# EAGLE design backplane (EAGLE 7.7.0)
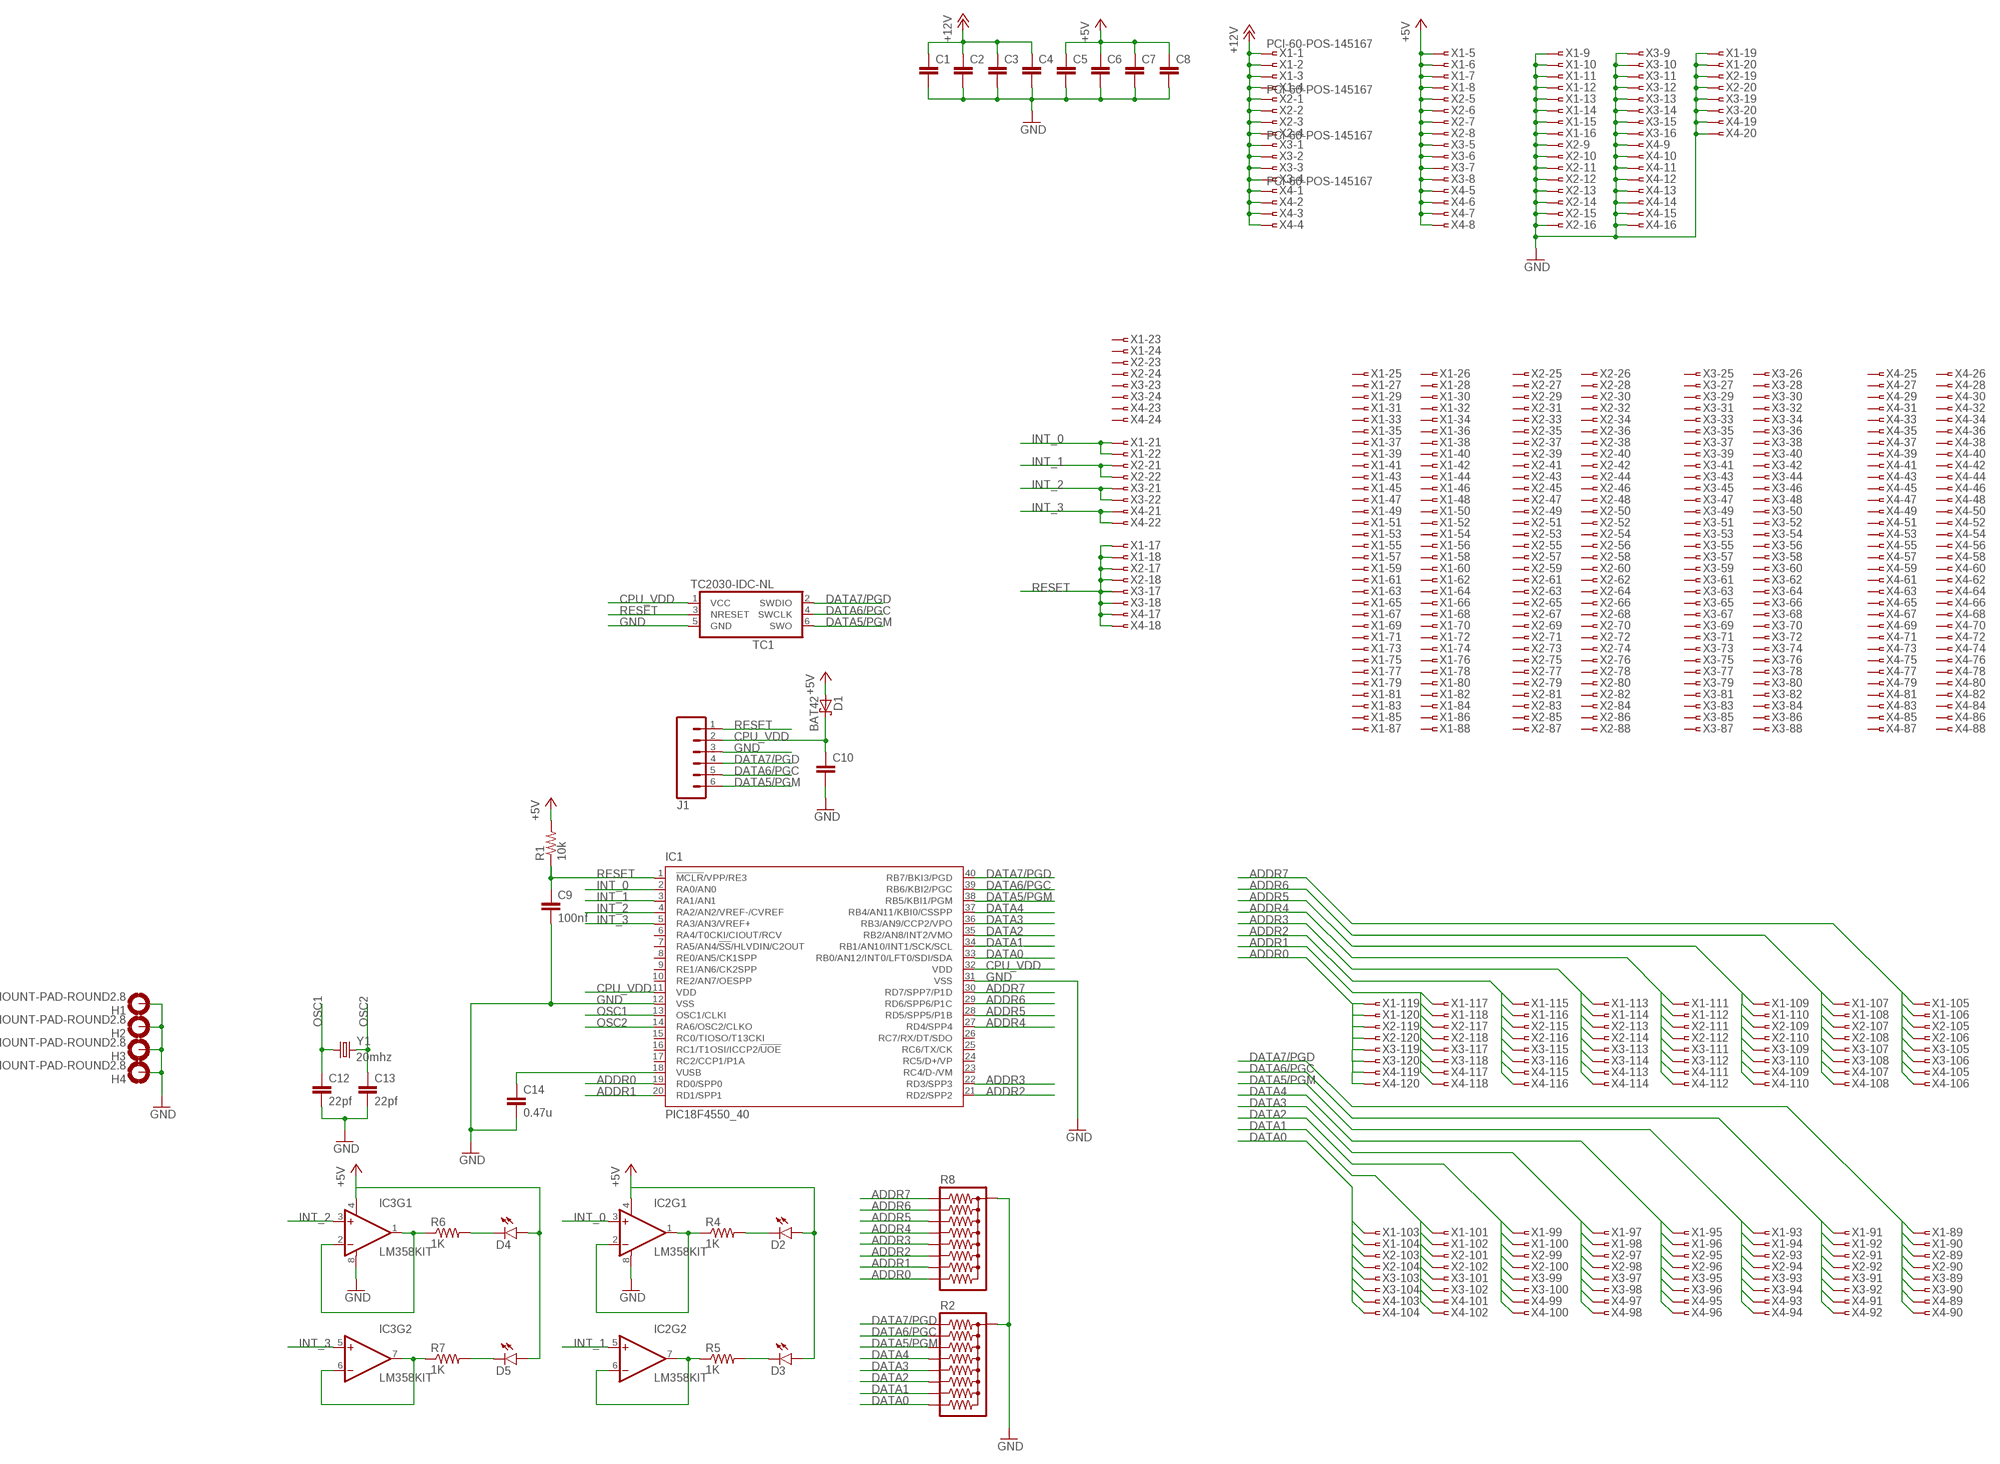
[diagram p0: schematic, sheet 1]

## Parts
C1  0.1UF-50V-20%(PTH)KIT-EZ  [CAP-PTH-SMALL-KIT]
C2  0.1UF-50V-20%(PTH)KIT-EZ  [CAP-PTH-SMALL-KIT]
C3  0.1UF-50V-20%(PTH)KIT-EZ  [CAP-PTH-SMALL-KIT]
C4  0.1UF-50V-20%(PTH)KIT-EZ  [CAP-PTH-SMALL-KIT]
C5  0.1UF-50V-20%(PTH)KIT-EZ  [CAP-PTH-SMALL-KIT]
C6  0.1UF-50V-20%(PTH)KIT-EZ  [CAP-PTH-SMALL-KIT]
C7  0.1UF-50V-20%(PTH)KIT-EZ  [CAP-PTH-SMALL-KIT]
C8  0.1UF-50V-20%(PTH)KIT-EZ  [CAP-PTH-SMALL-KIT]
C9  100nf  0.1UF-50V-20%(PTH)KIT-EZ  [CAP-PTH-SMALL-KIT]
C10  0.1UF-50V-20%(PTH)KIT-EZ  [CAP-PTH-SMALL-KIT]
C12  22pf  CAPKIT  [CAP-PTH-SMALL-KIT]
C13  22pf  CAPKIT  [CAP-PTH-SMALL-KIT]
C14  0.47u  CAPKIT  [CAP-PTH-SMALL-KIT]
D1  BAT42  [DO35-10]
D2  LED3MM  [LED3MM]
D3  LED3MM  [LED3MM]
D4  LED3MM  [LED3MM]
D5  LED3MM  [LED3MM]
H1  MOUNT-PAD-ROUND2.8  [2,8-PAD]
H2  MOUNT-PAD-ROUND2.8  [2,8-PAD]
H3  MOUNT-PAD-ROUND2.8  [2,8-PAD]
H4  MOUNT-PAD-ROUND2.8  [2,8-PAD]
IC1  PIC18F4550_40  [DIL40]
IC2  LM358KIT  [DIP08-KIT]
IC3  LM358KIT  [DIP08-KIT]
J1  M06POLAR_LOCK  [MOLEX-1X6_LOCK]
R1  10k  10KOHM-1/4W-1%(PTH)HORIZ-KIT  [AXIAL-0.3EZ]
R2  RPACK-BUSSED-8-SIP-PTH-8  [RPACK-SIP-PTH-8]
R4  1K  1KOHM-1/4W-1%(PTH)VERT-KIT  [AXIAL-0.1EZ]
R5  1K  1KOHM-1/4W-1%(PTH)VERT-KIT  [AXIAL-0.1EZ]
R6  1K  1KOHM-1/4W-1%(PTH)VERT-KIT  [AXIAL-0.1EZ]
R7  1K  1KOHM-1/4W-1%(PTH)VERT-KIT  [AXIAL-0.1EZ]
R8  RPACK-BUSSED-8-SIP-PTH-8  [RPACK-SIP-PTH-8]
TC1  TC2030-IDC-NL  [TC2030-IDC-NL]
X1  PCI-60-POS-145167  [145167-2]
X2  PCI-60-POS-145167  [145167-2]
X3  PCI-60-POS-145167  [145167-2]
X4  PCI-60-POS-145167  [145167-2]
Y1  20mhz  CRYSTALHC49UV  [HC49U-V]

## Nets
+5V: C5.1 C6.1 C7.1 C8.1 D1.A D2.A D3.A D4.A D5.A IC2.4(V-) IC3.4(V-) R1.P$2 X1.5 X1.6 X1.7 X1.8 X2.5 X2.6 X2.7 X2.8 X3.5 X3.6 X3.7 X3.8 X4.5 X4.6 X4.7 X4.8
+12V: C1.1 C2.1 C3.1 C4.1 X1.1 X1.2 X1.3 X1.4 X2.1 X2.2 X2.3 X2.4 X3.1 X3.2 X3.3 X3.4 X4.1 X4.2 X4.3 X4.4
ADDR0: IC1.19(RD0/SPP0) R8.P$9 X1.119 X1.120 X2.119 X2.120 X3.119 X3.120 X4.119 X4.120
ADDR1: IC1.20(RD1/SPP1) R8.P$8 X1.117 X1.118 X2.117 X2.118 X3.117 X3.118 X4.117 X4.118
ADDR2: IC1.21(RD2/SPP2) R8.P$7 X1.115 X1.116 X2.115 X2.116 X3.115 X3.116 X4.115 X4.116
ADDR3: IC1.22(RD3/SPP3) R8.P$6 X1.113 X1.114 X2.113 X2.114 X3.113 X3.114 X4.113 X4.114
ADDR4: IC1.27(RD4/SPP4) R8.P$5 X1.111 X1.112 X2.111 X2.112 X3.111 X3.112 X4.111 X4.112
ADDR5: IC1.28(RD5/SPP5/P1B) R8.P$4 X1.109 X1.110 X2.109 X2.110 X3.109 X3.110 X4.109 X4.110
ADDR6: IC1.29(RD6/SPP6/P1C) R8.P$3 X1.107 X1.108 X2.107 X2.108 X3.107 X3.108 X4.107 X4.108
ADDR7: IC1.30(RD7/SPP7/P1D) R8.P$2 X1.105 X1.106 X2.105 X2.106 X3.105 X3.106 X4.105 X4.106
CPU_VDD: C10.1 D1.C IC1.11(VDD) IC1.32(VDD) J1.2 TC1.1(VCC)
DATA0: IC1.33(RB0/AN12/INT0/LFT0/SDI/SDA) R2.P$9 X1.103 X1.104 X2.103 X2.104 X3.103 X3.104 X4.103 X4.104
DATA1: IC1.34(RB1/AN10/INT1/SCK/SCL) R2.P$8 X1.101 X1.102 X2.101 X2.102 X3.101 X3.102 X4.101 X4.102
DATA2: IC1.35(RB2/AN8/INT2/VMO) R2.P$7 X1.99 X1.100 X2.99 X2.100 X3.99 X3.100 X4.99 X4.100
DATA3: IC1.36(RB3/AN9/CCP2/VPO) R2.P$6 X1.97 X1.98 X2.97 X2.98 X3.97 X3.98 X4.97 X4.98
DATA4: IC1.37(RB4/AN11/KBI0/CSSPP) R2.P$5 X1.95 X1.96 X2.95 X2.96 X3.95 X3.96 X4.95 X4.96
DATA5/PGM: IC1.38(RB5/KBI1/PGM) J1.6 R2.P$4 TC1.6(SWO) X1.93 X1.94 X2.93 X2.94 X3.93 X3.94 X4.93 X4.94
DATA6/PGC: IC1.39(RB6/KBI2/PGC) J1.5 R2.P$3 TC1.4(SWCLK) X1.91 X1.92 X2.91 X2.92 X3.91 X3.92 X4.91 X4.92
DATA7/PGD: IC1.40(RB7/BKI3/PGD) J1.4 R2.P$2 TC1.2(SWDIO) X1.89 X1.90 X2.89 X2.90 X3.89 X3.90 X4.89 X4.90
GND: C1.2 C2.2 C3.2 C4.2 C5.2 C6.2 C7.2 C8.2 C9.2 C10.2 C12.2 C13.2 C14.2 H1.B2,8(MOUNT) H2.B2,8(MOUNT) H3.B2,8(MOUNT) H4.B2,8(MOUNT) IC1.12(VSS) IC1.31(VSS) IC2.8(V+) IC3.8(V+) J1.3 R2.P$1 R8.P$1 TC1.5(GND) X1.9 X1.10 X1.11 X1.12 X1.13 X1.14 X1.15 X1.16 X1.19 X1.20 X2.9 X2.10 X2.11 X2.12 X2.13 X2.14 X2.15 X2.16 X2.19 X2.20 X3.9 X3.10 X3.11 X3.12 X3.13 X3.14 X3.15 X3.16 X3.19 X3.20 X4.9 X4.10 X4.11 X4.12 X4.13 X4.14 X4.15 X4.16 X4.19 X4.20
INT_0: IC1.2(RA0/AN0) IC2.3(+IN) X1.21 X1.22
INT_1: IC1.3(RA1/AN1) IC2.5(+IN) X2.21 X2.22
INT_2: IC1.4(RA2/AN2/VREF-/CVREF) IC3.3(+IN) X3.21 X3.22
INT_3: IC1.5(RA3/AN3/VREF+) IC3.5(+IN) X4.21 X4.22
N$1: D2.K(C) R4.P$2
N$2: D3.K(C) R5.P$2
N$3: IC2.6(-IN) IC2.7(OUT) R5.P$1
N$4: IC2.1(OUT) IC2.2(-IN) R4.P$1
N$5: D4.K(C) R6.P$2
N$6: D5.K(C) R7.P$2
N$7: IC3.6(-IN) IC3.7(OUT) R7.P$1
N$8: IC3.1(OUT) IC3.2(-IN) R6.P$1
N$9: C14.1 IC1.18(VUSB)
OSC1: C12.1 IC1.13(OSC1/CLKI) Y1.1
OSC2: C13.1 IC1.14(RA6/OSC2/CLKO) Y1.2
RESET: C9.1 IC1.1(!MCLR!/VPP/RE3) J1.1 R1.P$1 TC1.3(NRESET) X1.17 X1.18 X2.17 X2.18 X3.17 X3.18 X4.17 X4.18
Unconnected: IC1.6(RA4/T0CKI/CIOUT/RCV) IC1.7(RA5/AN4/!SS!/HLVDIN/C2OUT) IC1.8(RE0/AN5/CK1SPP) IC1.9(RE1/AN6/CK2SPP) IC1.10(RE2/AN7/OESPP) IC1.15(RC0/TIOSO/T13CKI) IC1.16(RC1/T1OSI/ICCP2/!UOE) IC1.17(RC2/CCP1/P1A) IC1.23(RC4/D-/VM) IC1.24(RC5/D+/VP) IC1.25(RC6/TX/CK) IC1.26(RC7/RX/DT/SDO) X1.23 X1.24 X1.25 X1.26 X1.27 X1.28 X1.29 X1.30 X1.31 X1.32 X1.33 X1.34 X1.35 X1.36 X1.37 X1.38 X1.39 X1.40 X1.41 X1.42 X1.43 X1.44 X1.45 X1.46 X1.47 X1.48 X1.49 X1.50 X1.51 X1.52 X1.53 X1.54 X1.55 X1.56 X1.57 X1.58 X1.59 X1.60 X1.61 X1.62 X1.63 X1.64 X1.65 X1.66 X1.67 X1.68 X1.69 X1.70 X1.71 X1.72 X1.73 X1.74 X1.75 X1.76 X1.77 X1.78 X1.79 X1.80 X1.81 X1.82 X1.83 X1.84 X1.85 X1.86 X1.87 X1.88 X2.23 X2.24 X2.25 X2.26 X2.27 X2.28 X2.29 X2.30 X2.31 X2.32 X2.33 X2.34 X2.35 X2.36 X2.37 X2.38 X2.39 X2.40 X2.41 X2.42 X2.43 X2.44 X2.45 X2.46 X2.47 X2.48 X2.49 X2.50 X2.51 X2.52 X2.53 X2.54 X2.55 X2.56 X2.57 X2.58 X2.59 X2.60 X2.61 X2.62 X2.63 X2.64 X2.65 X2.66 X2.67 X2.68 X2.69 X2.70 X2.71 X2.72 X2.73 X2.74 X2.75 X2.76 X2.77 X2.78 X2.79 X2.80 X2.81 X2.82 X2.83 X2.84 X2.85 X2.86 X2.87 X2.88 X3.23 X3.24 X3.25 X3.26 X3.27 X3.28 X3.29 X3.30 X3.31 X3.32 X3.33 X3.34 X3.35 X3.36 X3.37 X3.38 X3.39 X3.40 X3.41 X3.42 X3.43 X3.44 X3.45 X3.46 X3.47 X3.48 X3.49 X3.50 X3.51 X3.52 X3.53 X3.54 X3.55 X3.56 X3.57 X3.58 X3.59 X3.60 X3.61 X3.62 X3.63 X3.64 X3.65 X3.66 X3.67 X3.68 X3.69 X3.70 X3.71 X3.72 X3.73 X3.74 X3.75 X3.76 X3.77 X3.78 X3.79 X3.80 X3.81 X3.82 X3.83 X3.84 X3.85 X3.86 X3.87 X3.88 X4.23 X4.24 X4.25 X4.26 X4.27 X4.28 X4.29 X4.30 X4.31 X4.32 X4.33 X4.34 X4.35 X4.36 X4.37 X4.38 X4.39 X4.40 X4.41 X4.42 X4.43 X4.44 X4.45 X4.46 X4.47 X4.48 X4.49 X4.50 X4.51 X4.52 X4.53 X4.54 X4.55 X4.56 X4.57 X4.58 X4.59 X4.60 X4.61 X4.62 X4.63 X4.64 X4.65 X4.66 X4.67 X4.68 X4.69 X4.70 X4.71 X4.72 X4.73 X4.74 X4.75 X4.76 X4.77 X4.78 X4.79 X4.80 X4.81 X4.82 X4.83 X4.84 X4.85 X4.86 X4.87 X4.88

## Library data of the parts
C1-C10 = SparkFun-Capacitors:0.1UF-50V-20%(PTH): CAP-08370; PROD_ID: CAP-08370
C12-C14 = SparkFun-Capacitors:CAP: Capacitor Standard 0603 ceramic capacitor, and 0.1" leaded capacitor.
D1 = diode:BAT42: DIODE barrier diode
D2-D5 = SparkFun-LED:LED: LEDs Standard schematic elements and footprints for 5mm, 3mm, 1206, and 0603 sized LEDs. 5mm - Spark Fun Electronics SKU : COM-00529 (and others); PROD_ID: DIO-08794
H1-H4 = holes:MOUNT-PAD-ROUND: MOUNTING PAD, round
IC1 = 00_cody:PIC18F4*_40: USB Microcontrollers with nanoWatt Technology High-Performance, Enhanced Flash, 28/40/44-Pin, Source: http://ww1.microchip.com/downloads/en/devicedoc/39632c.pdf; MF: MICROCHIP; MPN: PIC18F4550-I/P; OC_FARNELL: 9321357; OC_NEWARK: 74K8623
IC2 IC3 = SparkFun-AnalogIC:LM358: Jellybean op-amp; PROD_ID: IC-09172
J1 = SparkFun-Connectors:M06: Header 6 Standard 6-pin 0.1" header. Use with straight break away headers (SKU : PRT-00116), right angle break away headers (PRT-00553), swiss pins (PRT-00743), machine pins (PRT-00117), and female headers (PRT-00115). Molex polarized connector foot print use with SKU : PRT-08094 with associated crimp pins and housings. NOTES ON THE VARIANTS LOCK and LOCK_LONGPADS... This footprint was designed to help hold the alignment of a through-hole component (i.e. 6-pin header) while soldering it into place. You may notice that each hole has been shifted either up or down by 0.005 of an inch from it's more standard position (which is a perfectly straight line). This slight alteration caused the pins (the squares in the middle) to touch the edges of the holes. Because they are alternating, it causes a "brace" to hold the component in place. 0.005 has proven to be the perfect amount of "off-center" position when using our standard breakaway headers. Although looks a little odd when you look at the bare footprint, once you have a header in there, the alteration is very hard to notice. Also,if you push a header all the way into place, it is covered up entirely on the bottom side. This idea of altering the position of holes to aid alignment will be further integrated into the Sparkfun Library for other footprints. It can help hold any component with 3 or more connection pins.
R1 = SparkFun-Resistors:10KOHM-1/4W-1%(PTH): RES-12183; PROD_ID: RES-12183
R2 R8 = SparkFun-Resistors:RPACK-BUSSED-8: BOURNS 4600X/R series thick-film SIP resistor packs Height resistors bussed to a single pin (denoted by dot). datasheet <http://dlnmh9ip6v2uc.cloudfront.net/datasheets/Components/General/4600x.pdf> SIMILAR TO: SFE parts COM-10855 (330), COM-10856 (10K)
R4-R7 = SparkFun-Resistors:1KOHM-1/4W-1%(PTH): RES-12182; PROD_ID: RES-12182
TC1 = TagConnect:TC2030-IDC: Tag-Connect In Circuit Programming & Debug Cable 6 Pin http://www.tag-connect.com
X1-X4 = con-amp:PCI-60-POS: PCI-SLOT 60 Dual Position 0.05 Series Standard Edge Source: http://catalog.tycoelectronics.com .. ENG_CD_145167_F.pdf
Y1 = SparkFun-FreqCtrl:CRYSTAL: Various standard crystals. Proven footprints.

## Board
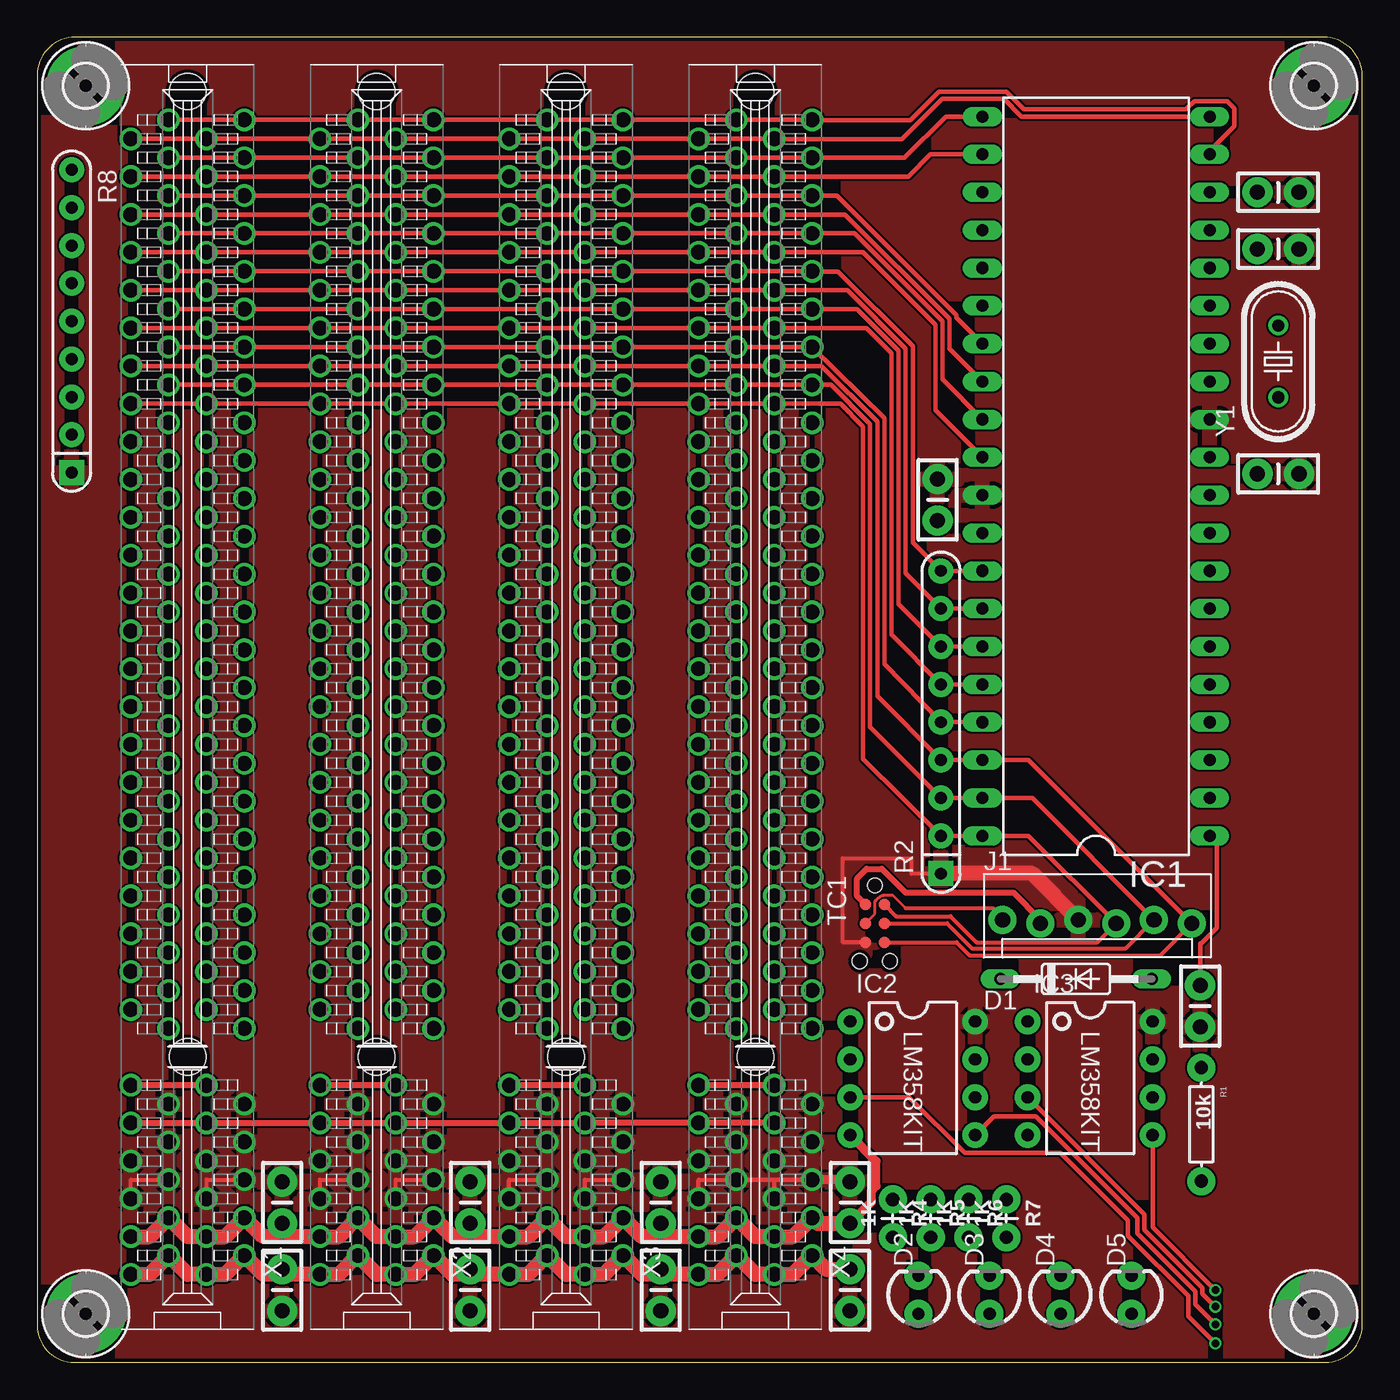
[diagram p1: board, top side]
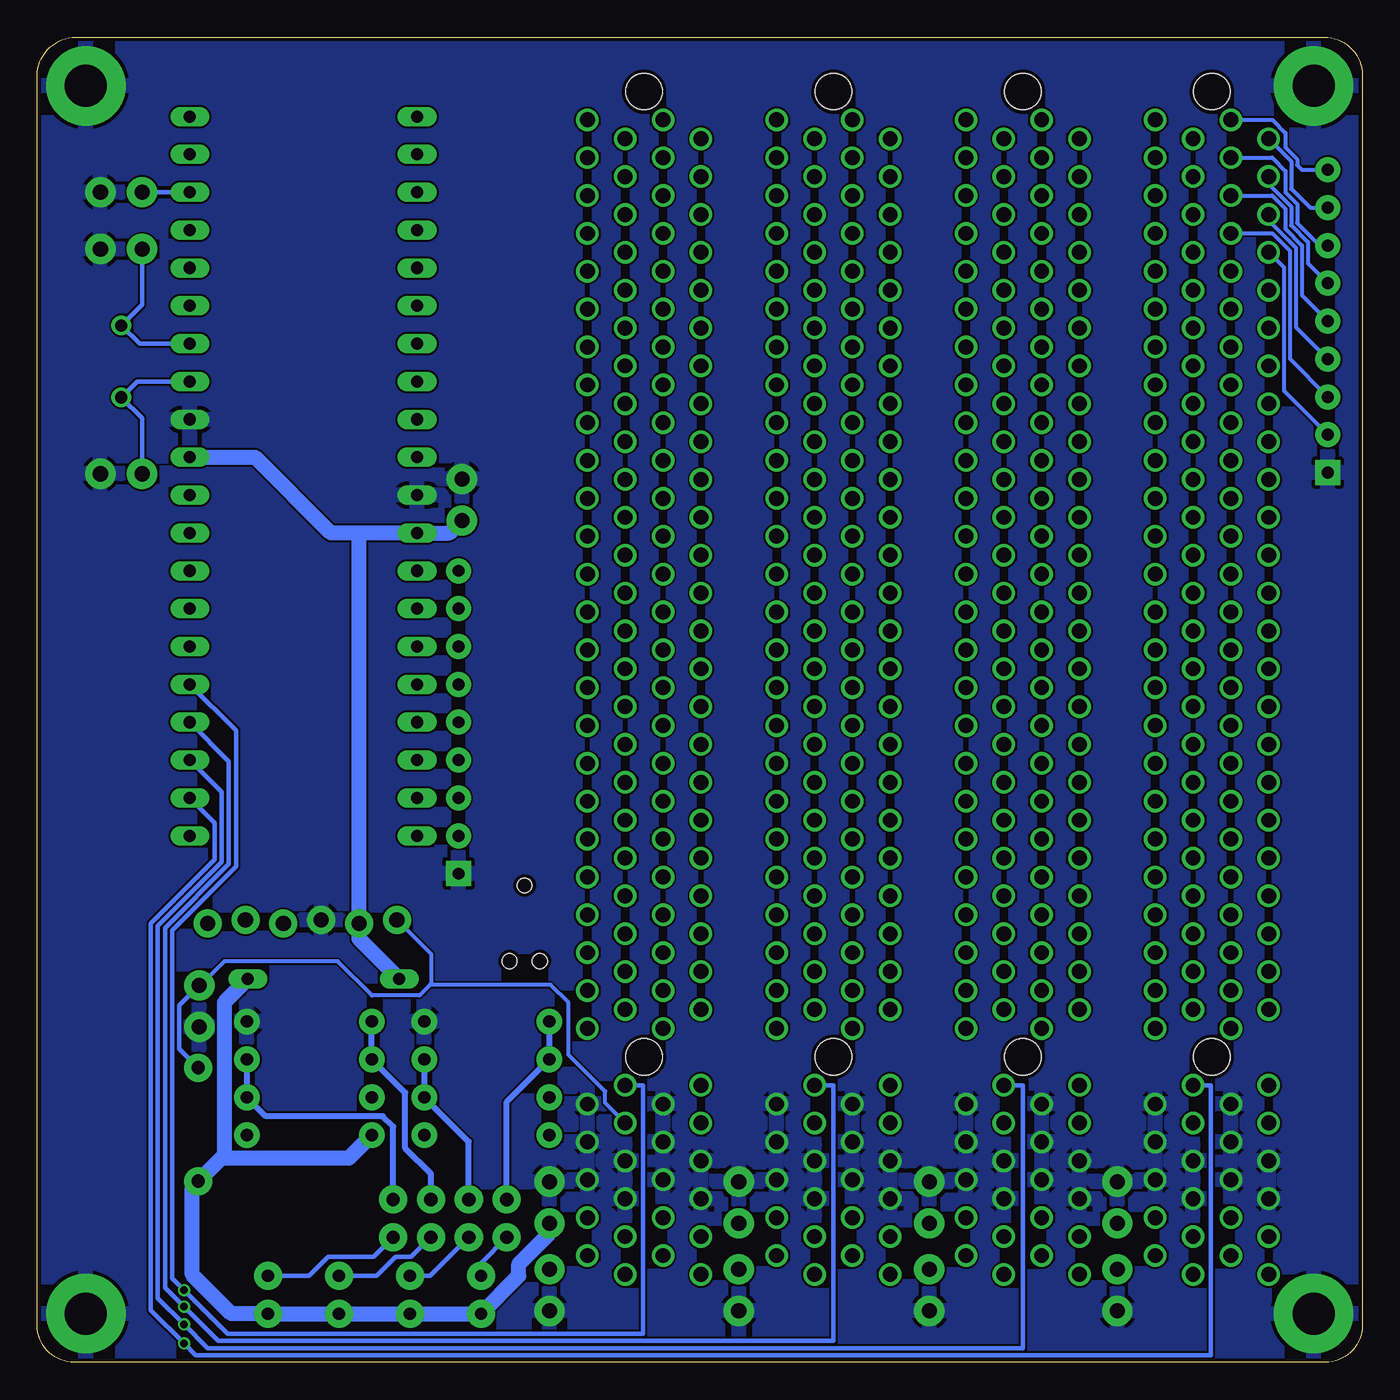
[diagram p2: board, bottom side, seen from below]

Size 88.9 x 88.9 mm. Coordinates in mm from the lower left corner, seen from the top.
Outline: 0,86.36 0,2.47 arc90 2.47,0 86.43,0 arc90 88.9,2.47 88.9,86.32 arc90 86.32,88.9 2.54,88.9 arc90 0,86.36
Copper layers (1*16): Top 0.035mm / dielectric 1.5mm / Bottom 0.035mm
Design rules "dirtypcbs": minimum track width 5mil, minimum drill 12mil, track to track 5mil, track to pad 5mil, pad to pad 5mil, via to via 5mil, smd to smd 0mil, copper to edge 10mil, drill to drill 10mil, minimum pad ring 10mil, minimum via ring 6mil, stop-mask expansion 2mil, vias tented up to drill 25mil, thermal gap 10mil

### Footprints (pad centres in the part's own frame; a part is rotated, then mirrored left to right if it is on the bottom)
CAP-PTH-SMALL-KIT = drill 1.016 pad 2.032: 1 -1.397,0; 2 1.397,0
DO35-10 = drill 0.813 long: A 5.08,0; C -5.08,0
LED3MM = drill 0.813 pad 1.88: A -1.27,0; K 1.27,0
2,8-PAD = drill 2.8 pad 5.334: B2,8 0,0
DIL40 = drill 0.813 long: 1 -24.13,-7.62; 2 -21.59,-7.62; 3 -19.05,-7.62; 4 -16.51,-7.62; 5 -13.97,-7.62; 6 -11.43,-7.62; 7 -8.89,-7.62; 8 -6.35,-7.62; 9 -3.81,-7.62; 10 -1.27,-7.62; 11 1.27,-7.62; 12 3.81,-7.62; 13 6.35,-7.62; 14 8.89,-7.62; 15 11.43,-7.62; 16 13.97,-7.62; 17 16.51,-7.62; 18 19.05,-7.62; 19 21.59,-7.62; 20 24.13,-7.62; 21 24.13,7.62; 22 21.59,7.62; 23 19.05,7.62; 24 16.51,7.62; 25 13.97,7.62; 26 11.43,7.62; 27 8.89,7.62; 28 6.35,7.62; 29 3.81,7.62; 30 1.27,7.62; 31 -1.27,7.62; 32 -3.81,7.62; 33 -6.35,7.62; 34 -8.89,7.62; 35 -11.43,7.62; 36 -13.97,7.62; 37 -16.51,7.62; 38 -19.05,7.62; 39 -21.59,7.62; 40 -24.13,7.62
DIP08-KIT = drill 0.813 pad 1.727: 1 -3.81,-4.191; 2 -1.27,-4.191; 3 1.27,-4.191; 4 3.81,-4.191; 5 3.81,4.191; 6 1.27,4.191; 7 -1.27,4.191; 8 -3.81,4.191
MOLEX-1X6_LOCK = drill 1.016 pad 1.88: 1 0,0; 2 2.54,-0.254; 3 5.08,0; 4 7.62,-0.254; 5 10.16,0; 6 12.7,-0.254
AXIAL-0.3EZ = drill 0.9 pad 1.88: P$1 -3.81,0; P$2 3.81,0
RPACK-SIP-PTH-8 = drill 0.8 pad 1.676 square: P$1 0,0 | drill 0.8 pad 1.676: P$2 0,-2.54; P$3 0,-5.08; P$4 0,-7.62; P$5 0,-10.16; P$6 0,-12.7; P$7 0,-15.24; P$8 0,-17.78; P$9 0,-20.32
AXIAL-0.1EZ = drill 0.9 pad 1.88: P$1 0,0; P$2 2.54,0
TC2030-IDC-NL = smd 0.787 x 0.787: 1 -1.27,-0.635; 2 -1.27,0.635; 3 0,-0.635; 4 0,0.635; 5 1.27,-0.635; 6 1.27,0.635 | hole 0.991: -2.54,0; 2.54,1.016; 2.54,-1.016
145167-2 = drill 1 pad 1.2: 1 0.254,-1.27; 2 0.254,3.81; 3 1.524,-3.81; 4 1.524,1.27; 5 2.794,-1.27; 6 2.794,3.81; 7 4.064,-3.81; 8 4.064,1.27; 9 5.334,-1.27; 10 5.334,3.81; 11 6.604,-3.81; 12 6.604,1.27; 13 7.874,-1.27; 14 7.874,3.81; 15 9.144,-3.81; 16 9.144,1.27; 17 10.414,-1.27; 18 10.414,3.81; 19 11.684,-3.81; 20 11.684,1.27; 21 12.954,-1.27; 22 12.954,3.81; 23 16.764,-3.81; 24 16.764,1.27; 25 18.034,-1.27; 26 18.034,3.81; 27 19.304,-3.81; 28 19.304,1.27; 29 20.574,-1.27; 30 20.574,3.81; 31 21.844,-3.81; 32 21.844,1.27; 33 23.114,-1.27; 34 23.114,3.81; 35 24.384,-3.81; 36 24.384,1.27; 37 25.654,-1.27; 38 25.654,3.81; 39 26.924,-3.81; 40 26.924,1.27; 41 28.194,-1.27; 42 28.194,3.81; 43 29.464,-3.81; 44 29.464,1.27; 45 30.734,-1.27; 46 30.734,3.81; 47 32.004,-3.81; 48 32.004,1.27; 49 33.274,-1.27; 50 33.274,3.81; 51 34.544,-3.81; 52 34.544,1.27; 53 35.814,-1.27; 54 35.814,3.81; 55 37.084,-3.81; 56 37.084,1.27; 57 38.354,-1.27; 58 38.354,3.81; 59 39.624,-3.81; 60 39.624,1.27; 61 40.894,-1.27; 62 40.894,3.81; 63 42.164,-3.81; 64 42.164,1.27; 65 43.434,-1.27; 66 43.434,3.81; 67 44.704,-3.81; 68 44.704,1.27; 69 45.974,-1.27; 70 45.974,3.81; 71 47.244,-3.81; 72 47.244,1.27; 73 48.514,-1.27; 74 48.514,3.81; 75 49.784,-3.81; 76 49.784,1.27; 77 51.054,-1.27; 78 51.054,3.81; 79 52.324,-3.81; 80 52.324,1.27; 81 53.594,-1.27; 82 53.594,3.81; 83 54.864,-3.81; 84 54.864,1.27; 85 56.134,-1.27; 86 56.134,3.81; 87 57.404,-3.81; 88 57.404,1.27; 89 58.674,-1.27; 90 58.674,3.81; 91 59.944,-3.81; 92 59.944,1.27; 93 61.214,-1.27; 94 61.214,3.81; 95 62.484,-3.81; 96 62.484,1.27; 97 63.754,-1.27; 98 63.754,3.81; 99 65.024,-3.81; 100 65.024,1.27; 101 66.294,-1.27; 102 66.294,3.81; 103 67.564,-3.81; 104 67.564,1.27; 105 68.834,-1.27; 106 68.834,3.81; 107 70.104,-3.81; 108 70.104,1.27; 109 71.374,-1.27; 110 71.374,3.81; 111 72.644,-3.81; 112 72.644,1.27; 113 73.914,-1.27; 114 73.914,3.81; 115 75.184,-3.81; 116 75.184,1.27; 117 76.454,-1.27; 118 76.454,3.81; 119 77.724,-3.81; 120 77.724,1.27 | hole 2.44: 14.854,0; 79.624,0
HC49U-V = drill 0.813: 1 -2.413,0; 2 2.413,0

### Placement (x,y rotation side)
C1  16.43,4.84 270 top
C2  29.05,4.84 270 top
C3  41.83,4.84 270 top
C4  54.53,4.84 270 top
C5  16.43,10.72 90 top
C6  29.05,10.72 90 top
C7  41.83,10.72 90 top
C8  54.53,10.72 90 top
C9  78.03,23.89 270 top
C10  60.4,57.86 90 top
C12  83.26,59.61 0 top
C13  83.26,74.69 0 top
C14  83.26,78.5 0 top
D1  69.69,25.72 0 top
D2  59.13,4.52 90 top
D3  63.9,4.52 90 top
D4  68.66,4.52 90 top
D5  73.42,4.52 90 top
H1  3.25,3.25 0 top
H2  85.65,3.25 0 top
H3  85.65,85.65 0 top
H4  3.25,85.65 0 top
IC1  71.04,59.45 90 top
IC2  58.74,19.05 270 top
IC3  70.64,19.05 270 top
J1  64.77,29.69 0 top
R1  78.11,15.95 270 top
R2  60.64,32.78 180 top
R4  57.4,10.92 270 top
R5  59.94,10.92 270 top
R6  62.48,10.92 270 top
R7  65.02,10.92 270 top
R8  2.3,59.69 180 top
TC1  56.2,29.45 270 top
X1  10.08,5.64 90 top
X2  22.78,5.64 90 top
X3  35.48,5.64 90 top
X4  48.18,5.64 90 top
Y1  83.26,67.15 90 top

### Tracks (layer width: path | path; a pad name or v marks a point on that pad's centre or on a via)
+5V
  Top 0.406: C5.1 16.43,8.43 X2.6 | C6.1 29.05,8.43 X3.6 | C7.1 41.83,8.43 X4.6
  Top 0.61: C8.1 55.96,10.75 55.96,11.51 56.28,11.83 56.28,13.49 54.55,15.22 IC2.4
  Top 1.016: X1.6 7.54,8.43 X1.8 10.08,8.43 X1.5 12.62,8.43 X1.7 15.16,8.43 X2.6 20.24,8.43 X2.8 22.78,8.43 X2.5 25.32,8.43 X2.7 27.86,8.43 X3.6 32.94,8.43 X3.8 35.48,8.43 X3.5 38.02,8.43 X3.7 40.56,8.43 X4.6 45.64,8.43 X4.8 48.18,8.43 X4.5 50.72,8.43 X4.7 52.37,9.32 C8.1
  Bottom 1.016: D1.A 76.36,24.13 76.36,13.89 76.56,13.69 | 76.56,13.69 R1.P$2 78.5,11.75 78.5,5.87 75.88,3.25 D5.A D4.A D3.A D2.A 56.59,5.79 56.59,6.59 54.53,8.65 C8.1 | IC3.4 68,13.69 76.56,13.69
+12V
  Top 1.016: X1.2 7.54,5.89 X1.4 10.08,5.89 X1.1 12.62,5.89 X1.3 15.16,5.89 16.78,5.89 | 28.7,5.89 X3.2 32.94,5.89 X3.4 35.48,5.89 X3.1 38.02,5.89 X3.3 40.56,5.89 41.48,5.89 | 41.48,5.89 X4.2 45.64,5.89 X4.4 48.18,5.89 X4.1 50.72,5.89 X4.3 52.91,6.24 C4.1 | 16.78,5.89 X2.2 20.24,5.89 X2.4 22.78,5.89 X2.1 25.32,5.89 X2.3 27.86,5.89 28.7,5.89 | C2.1 28.7,5.89 | C1.1 16.78,5.89 | C3.1 41.48,5.89
ADDR0
  Top 0.305: X1.120 X1.119 X2.120 X2.119 X3.120 X3.119 X4.120 X4.119 52.01,83.34 58.58,83.34 60.48,85.25 65.01,85.25 66.2,84.06 77.07,84.06 77.63,84.61 79.85,84.61 80.33,84.14 80.33,82.95 78.66,81.28 IC1.19
  Bottom 0.254: X1.120 6.05,83.36 5.16,82.47 5.16,81.52 4.37,80.72 4.37,80.33 4.05,80.01 R8.P$9
ADDR1
  Top 0.305: X1.118 X1.117 X2.118 X2.117 X3.118 X3.117 X4.118 X4.117 49.47,82.07 58.02,82.07 60.72,84.77 64.85,84.77 66.04,83.58 IC1.20
  Bottom 0.254: X1.118 4.76,80.58 4.76,78.74 3.49,77.47 R8.P$8
ADDR2
  Top 0.305: X1.116 X1.115 X2.116 X2.115 X3.116 X3.115 X4.116 X4.115 52.01,80.8 58.18,80.8 60.96,83.58 IC1.21
  Bottom 0.254: X1.116 6.05,80.82 5.16,79.93 5.16,78.5 4.37,77.71 4.37,76.44 2.86,74.93
  Bottom 0.305: 2.86,74.93 R8.P$7
ADDR3
  Top 0.305: X1.114 X1.113 X2.114 X2.113 X3.114 X3.113 X4.114 X4.113 58.44,79.55 59.93,81.04 IC1.22
  Bottom 0.254: X1.114 6.27,79.06 4.76,77.55 4.76,76.28 3.65,75.17 3.65,73.74 R8.P$6
ADDR4
  Top 0.305: X1.112 X1.111 X2.112 X2.111 X3.112 X3.111 X4.112 X4.111 53.64,78.28 61.67,70.25 61.67,70.09 IC1.27
  Bottom 0.254: X1.112 6.05,78.28 5.16,77.39 5.16,76.04 4.05,74.93 4.05,71.6 R8.P$5
ADDR5
  Top 0.305: X1.110 X1.109 X2.110 X2.109 X3.110 X3.109 X4.110 X4.109 54.2,77.01 61.2,70.01 61.2,68.02 IC1.28
  Bottom 0.254: X1.110 6.27,76.6 4.45,74.77 4.45,69.45 R8.P$4
ADDR6
  Top 0.305: X1.108 X1.107 X2.108 X2.107 X3.108 X3.107 X4.108 X4.107 54.83,75.74 60.72,69.85 60.72,65.96 IC1.29
  Bottom 0.254: R8.P$3 4.84,67.31 4.84,74.53 6.05,75.74 X1.108
ADDR7
  Top 0.305: X1.106 X1.105 X2.106 X2.105 X3.106 X3.105 X4.106 X4.105 55.39,74.47 60.25,69.61 60.25,63.9 IC1.30
  Bottom 0.254: R8.P$2 5.24,65.17 5.24,73.44 X1.106
CPU_VDD
  Top 0.406: TC1.1 55.01,31.27 55.01,32.46 55.64,33.1 56.67,33.1 58.26,31.51 65.48,31.51 67.31,29.69 J1.2
  Bottom 1.016: 67.31,55.64 IC1.32 61.23,55.64 C10.1 | 67.31,55.64 69.22,55.64 74.3,60.72 IC1.11 | 67.31,55.64 J1.2 67.31,28.42 D1.C
DATA0
  Top 0.305: X1.104 X1.103 X2.104 X2.103 X3.104 X3.103 X4.104 X4.103 52.01,73.18 53.74,73.18 58.74,68.18 58.74,55.01 R2.P$9 IC1.33
DATA1
  Top 0.305: X1.102 X1.101 X2.102 X2.101 X3.102 X3.101 X4.102 X4.101 54.36,71.93 58.26,68.02 58.26,52.94 R2.P$8 IC1.34
DATA2
  Top 0.305: X1.100 X1.99 X2.100 X2.99 X3.100 X3.99 X4.100 X4.99 54.99,70.66 57.78,67.87 57.78,50.88 R2.P$7 IC1.35
DATA3
  Top 0.305: X1.98 X1.97 X2.98 X2.97 X3.98 X3.97 X4.98 X4.97 55.63,69.39 57.31,67.71 57.31,48.82 R2.P$6 IC1.36
DATA4
  Top 0.305: X1.96 X1.95 X2.96 X2.95 X3.96 X3.95 X4.96 X4.95 56.83,63.36 56.83,46.83 R2.P$5 IC1.37
DATA5/PGM
  Top 0.254: TC1.6 61.67,28.18 62.55,27.3 75.34,27.3 J1.6
  Top 0.305: J1.6 66.5,40.4 IC1.38 R2.P$4 56.36,44.69 56.36,63.1 52.61,66.85 X4.93 X4.94 X3.93 X3.94 X2.93 X2.94 X1.93 X1.94
DATA6/PGC
  Top 0.254: TC1.4 61.04,29.45 62.71,27.78 73.03,27.78 J1.5
  Top 0.305: J1.5 66.75,37.86 IC1.39 R2.P$3 55.88,42.62 55.88,62.94 53.24,65.58 X4.91 X4.92 X3.91 X3.92 X2.91 X2.92 X1.91 X1.92
DATA7/PGD
  Top 0.254: J1.4 71.14,28.18 63.02,28.18 61.28,29.92 57.63,29.92 TC1.2
  Top 0.305: J1.4 66.5,35.32 IC1.40 R2.P$2 55.4,40.48 55.4,62.79 53.88,64.31 X4.89 X4.90 X3.89 X3.90 X2.89 X2.90 X1.89 X1.90
GND
  Top 0.254: X2.9 24.05,12.24 X2.11 | X3.10 31.67,12.24 X3.12 | X3.9 36.75,12.24 X3.11 | X2.10 18.97,12.24 X2.12 | X1.9 11.35,12.24 X1.11 | X1.10 6.27,12.24 X1.12 | X4.10 44.37,12.24 X4.12 | X4.9 49.45,12.24 X4.11 | TC1.5 54.05,28.18 54.05,33.81 58.66,33.81 58.66,32.78 R2.P$1
  Top 0.305: X4.12 X4.11
  Top 0.61: C8.2 54.4,12.24 X4.11
  Top 1.016: J1.3 66.75,32.78 R2.P$1
  pour Bottom: 0,0 88.9,0 88.9,88.9 0,88.9
  pour Top: 0,0 88.9,0 88.9,88.9 0,88.9
INT_0  (via drill 0.5)
  Top 0.305: IC2.3 58.5,17.78 62.23,14.05 68.66,14.05 73.18,9.53 73.18,8.49 77.23,4.45 77.23,3.1 v79.06,1.27
  Top 0.406: X1.21 X1.22
  Bottom 0.305: X1.21 10.16,18.59 10.16,0.48 78.26,0.48 v79.06,1.27 81.28,3.49 81.28,29.45 76.99,33.73 76.99,36.2 IC1.2
INT_1  (via drill 0.5)
  Top 0.305: v79.06,2.54 77.71,3.89 77.71,4.76 73.82,8.65 73.82,9.68 66.99,16.51 64.2,16.51 IC2.5
  Top 0.406: X2.21 X2.22
  Bottom 0.305: IC1.3 76.52,38.26 76.52,33.58 80.8,29.29 80.8,4.29 v79.06,2.54 77.47,0.95 22.78,0.95 22.78,18.59 X2.21
INT_2  (via drill 0.5)
  Top 0.305: IC3.3 74.3,9.94 74.3,8.89 78.18,5 78.18,4.6 v79.06,3.73
  Top 0.406: X3.21 X3.22
  Bottom 0.305: X3.21 35.48,18.59 35.48,1.43 76.76,1.43 v79.06,3.73 80.33,5 80.33,29.13 76.04,33.42 76.04,40.32 IC1.4
INT_3  (via drill 0.5)
  Top 0.305: v79.06,4.84 74.83,9.06 IC3.5
  Top 0.406: X4.21 X4.22
  Bottom 0.305: X4.21 48.26,18.59 48.26,1.91 76.12,1.91 v79.06,4.84 79.85,5.64 79.85,28.97 75.56,33.26 75.56,42.39 IC1.5
N$1
  Bottom 0.305: D2.K 59.13,6.65 R4.P$2
N$2
  Bottom 0.305: D3.K 62.53,5.79 R5.P$2
N$3
  Bottom 0.406: IC2.7 IC2.6 59.94,14.8 R5.P$1
N$4
  Bottom 0.406: R4.P$1 57.4,17.46 IC2.2 IC2.1
N$5
  Bottom 0.305: D4.K 66.12,5.79 64.85,7.06 63.8,7.06 R6.P$2
N$6
  Bottom 0.305: D5.K 70.64,5.79 69.37,7.06 66.34,7.06 R7.P$2
N$7
  Bottom 0.406: R7.P$1 65.02,15.81 65.72,16.51 73.56,16.51 IC3.6 IC3.7
N$8
  Bottom 0.406: R6.P$1 62.48,12.64 64.21,14.37 64.21,18.08 IC3.2 IC3.1
N$9
  Bottom 0.305: IC1.18 C14.1
OSC1
  Bottom 0.305: C12.1 81.87,63.34 Y1.1 82.2,65.8 IC1.13
OSC2
  Bottom 0.305: C13.1 81.87,70.96 Y1.2 82.04,68.34 IC1.14
RESET
  Top 0.191: TC1.3 56.2,30.08 56.2,30.88 arc-50 56.83,31.35 57.39,31.35 58.26,30.48
  Top 0.254: 58.26,30.48 64.14,30.48 64.77,29.84 J1.1
  Top 0.305: IC1.1 78.74,35.24 79.14,35.24 79.14,29.13 78.11,28.1 78.03,28.1 C9.1
  Top 0.406: X1.18 X1.17 X2.18 X2.17 X3.18 X3.17 X4.18 X4.17
  Bottom 0.254: J1.1 62.47,27.38 62.47,25.4 62.55,25.32 | 62.55,25.32 63.26,24.61 66.44,24.61 68.74,26.91 76.36,26.91 77.98,25.29 C9.1 | X4.17 50.8,17.4 50.8,18.18 53.26,20.64 53.26,24.13 54.45,25.32 62.55,25.32
  Bottom 0.305: R1.P$1 79.38,21.03 79.38,23.94 C9.1